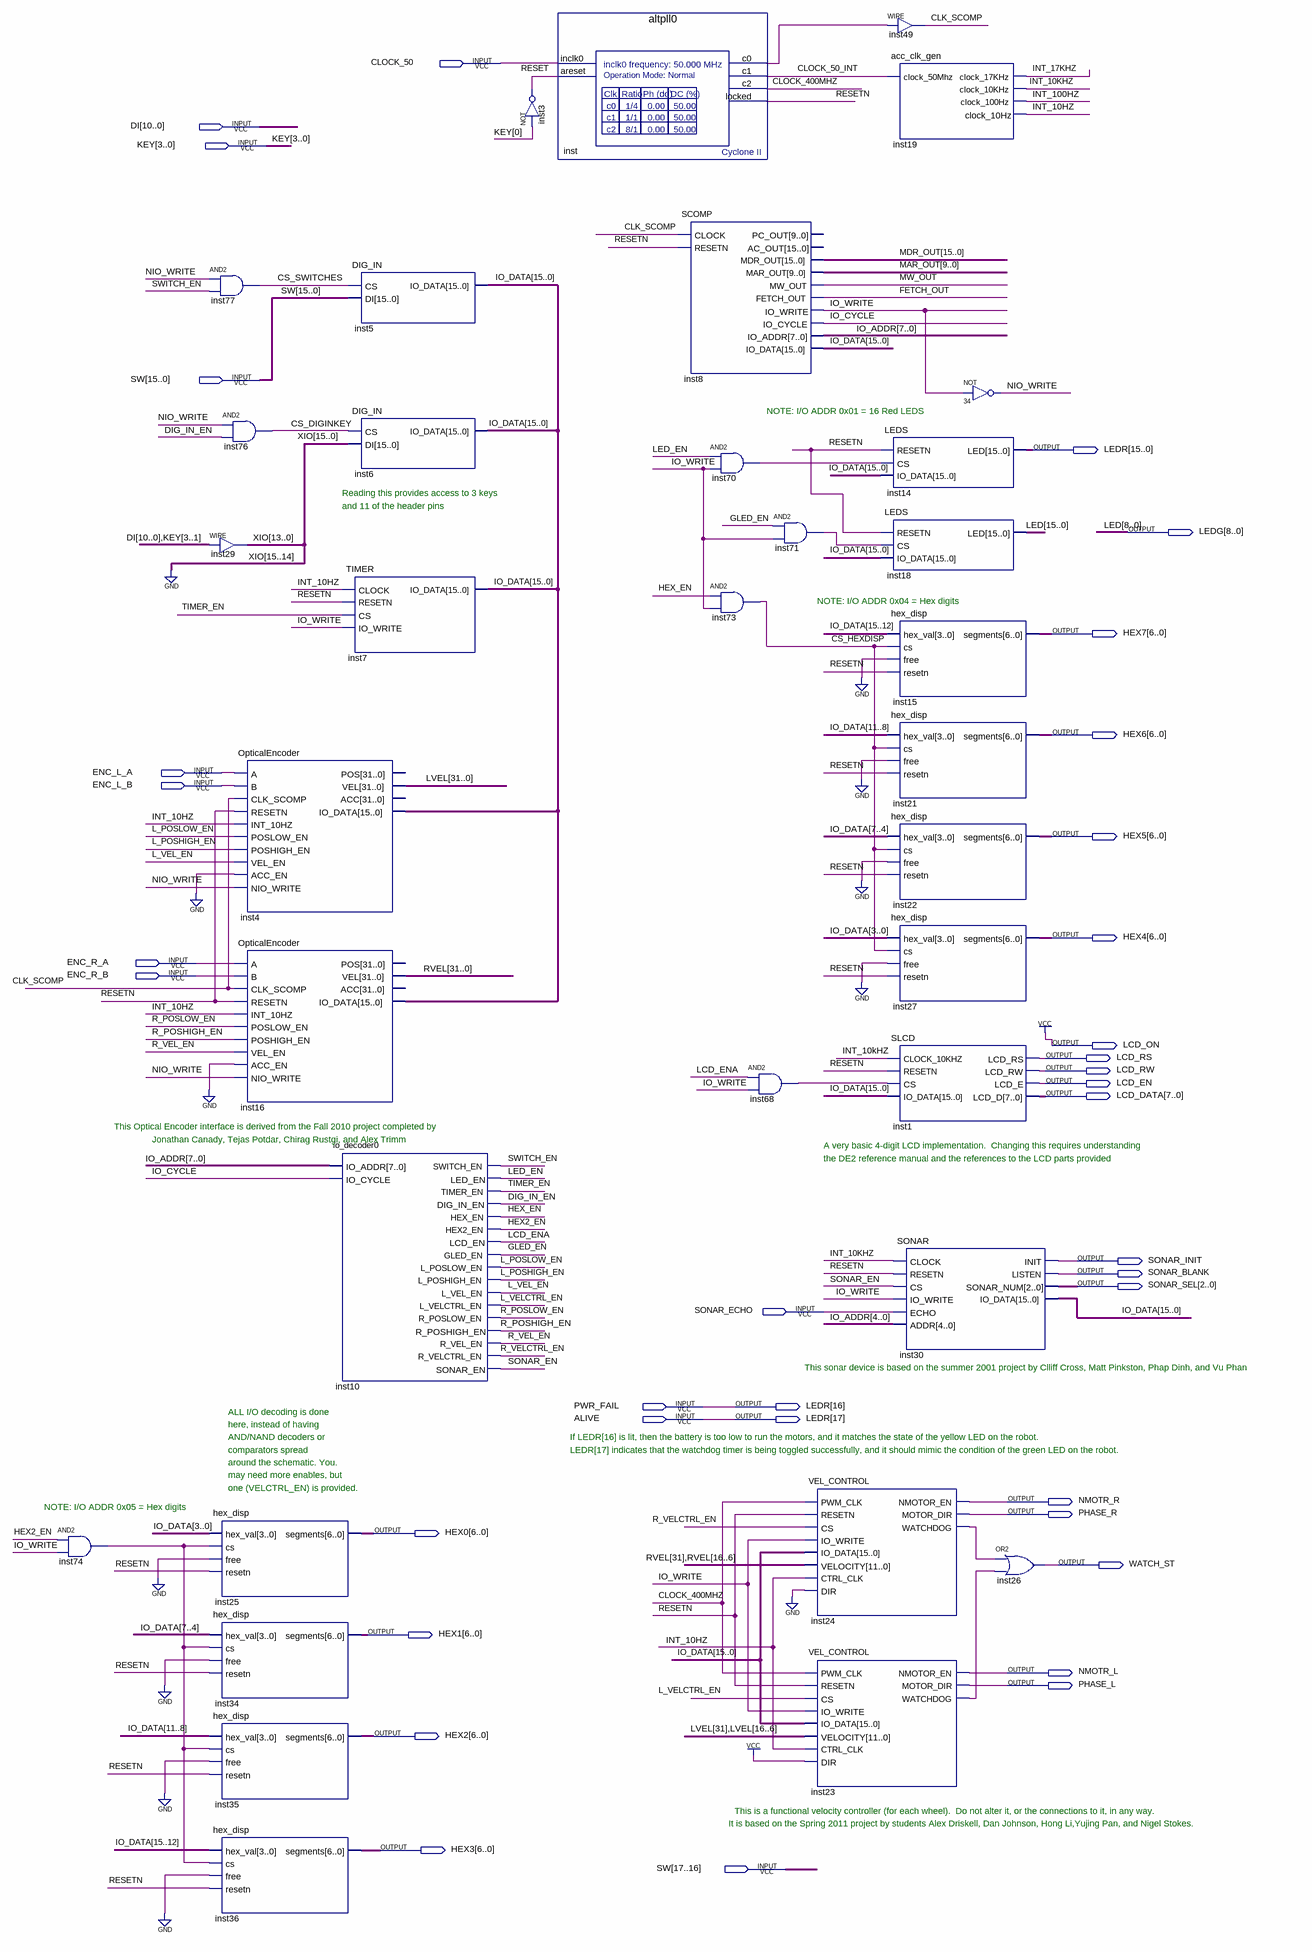
[diagram p0: schematic sheet]
// Quartus schematic DE2bot.bdf as structural Verilog: 35 symbols, 37 pins
module DE2bot (
  input  CLOCK_50,
  input  [10:0] DI,
  input  [3:0] KEY,
  input  [17:0] SW,
  input  ENC_L_A,
  input  ENC_L_B,
  input  ENC_R_A,
  input  ENC_R_B,
  input  SONAR_ECHO,
  input  PWR_FAIL,
  input  ALIVE,
  output [17:0] LEDR,
  output [8:0] LEDG,
  output [6:0] HEX7,
  output [6:0] HEX6,
  output [6:0] HEX5,
  output [6:0] HEX4,
  output LCD_ON,
  output LCD_RS,
  output LCD_RW,
  output LCD_EN,
  output [7:0] LCD_DATA,
  output SONAR_INIT,
  output SONAR_BLANK,
  output [2:0] SONAR_SEL,
  output NMOTR_R,
  output PHASE_R,
  output [6:0] HEX0,
  output WATCH_ST,
  output [6:0] HEX1,
  output NMOTR_L,
  output PHASE_L,
  output [6:0] HEX2,
  output [6:0] HEX3
);

  wire CLK_SCOMP, CLOCK_50_INT, CLOCK_400MHZ, CS_DIGINKEY, CS_HEXDISP, CS_SWITCHES, DIG_IN_EN, FETCH_OUT,
       GLED_EN, HEX2_EN, HEX_EN, inst23_watchdog, inst24_watchdog, inst68_out, inst70_out, inst71_out,
       inst74_out, inst_c0, INT_10HZ, INT_10kHZ, INT_17KHZ, INT_100HZ, IO_CYCLE, IO_WRITE, L_POSHIGH_EN,
       L_POSLOW_EN, L_VEL_EN, L_VELCTRL_EN, LCD_ENA, LED_EN, MW_OUT, NIO_WRITE, R_POSHIGH_EN, R_POSLOW_EN,
       R_VEL_EN, R_VELCTRL_EN, RESET, RESETN, SONAR_EN, SWITCH_EN, TIMER_EN;
  wire [7:0] IO_ADDR;
  wire [9:0] MAR_OUT;
  wire [13:0] XIO;
  wire [15:0] IO_DATA, MDR_OUT;
  wire [15:9] LED;
  wire [31:0] LVEL, RVEL;

  and inst74 (inst74_out, HEX2_EN, IO_WRITE);
  and inst77 (CS_SWITCHES, NIO_WRITE, SWITCH_EN);
  assign XIO = {DI, KEY[3:1]};  // WIRE inst29
  hex_disp inst25 (.hex_val(IO_DATA[3:0]), .cs(inst74_out), .free(1'b0), .resetn(RESETN), .segments(HEX0));
  hex_disp inst34 (.hex_val(IO_DATA[7:4]), .cs(inst74_out), .free(1'b0), .resetn(RESETN), .segments(HEX1));
  hex_disp inst35 (.hex_val(IO_DATA[11:8]), .cs(inst74_out), .free(1'b0), .resetn(RESETN), .segments(HEX2));
  hex_disp inst36 (.hex_val(IO_DATA[15:12]), .cs(inst74_out), .free(1'b0), .resetn(RESETN), .segments(HEX3));
  and inst76 (CS_DIGINKEY, NIO_WRITE, DIG_IN_EN);
  OpticalEncoder inst4 (
    .A(ENC_L_A), .B(ENC_L_B), .CLK_SCOMP(CLK_SCOMP), .RESETN(RESETN), .INT_10HZ(INT_10HZ),
    .POSLOW_EN(L_POSLOW_EN), .POSHIGH_EN(L_POSHIGH_EN), .VEL_EN(L_VEL_EN), .ACC_EN(1'b0),
    .NIO_WRITE(NIO_WRITE), .VEL(LVEL), .IO_DATA(IO_DATA));  // open: POS, ACC
  OpticalEncoder inst16 (
    .A(ENC_R_A), .B(ENC_R_B), .CLK_SCOMP(CLK_SCOMP), .RESETN(RESETN), .INT_10HZ(INT_10HZ),
    .POSLOW_EN(R_POSLOW_EN), .POSHIGH_EN(R_POSHIGH_EN), .VEL_EN(R_VEL_EN), .ACC_EN(1'b0),
    .NIO_WRITE(NIO_WRITE), .VEL(RVEL), .IO_DATA(IO_DATA));  // open: POS, ACC
  DIG_IN inst5 (.CS(CS_SWITCHES), .DI(SW[15:0]), .IO_DATA(IO_DATA));
  DIG_IN inst6 (.CS(CS_DIGINKEY), .DI({2'b00, XIO}), .IO_DATA(IO_DATA));
  TIMER inst7 (.CLOCK(INT_10HZ), .RESETN(RESETN), .CS(TIMER_EN), .IO_WRITE(IO_WRITE), .IO_DATA(IO_DATA));
  io_decoder0 inst10 (
    .IO_ADDR(IO_ADDR), .IO_CYCLE(IO_CYCLE), .SWITCH_EN(SWITCH_EN), .LED_EN(LED_EN), .TIMER_EN(TIMER_EN),
    .DIG_IN_EN(DIG_IN_EN), .HEX_EN(HEX_EN), .HEX2_EN(HEX2_EN), .LCD_EN(LCD_ENA), .GLED_EN(GLED_EN),
    .L_POSLOW_EN(L_POSLOW_EN), .L_POSHIGH_EN(L_POSHIGH_EN), .L_VEL_EN(L_VEL_EN), .L_VELCTRL_EN(L_VELCTRL_EN),
    .R_POSLOW_EN(R_POSLOW_EN), .R_POSHIGH_EN(R_POSHIGH_EN), .R_VEL_EN(R_VEL_EN), .R_VELCTRL_EN(R_VELCTRL_EN),
    .SONAR_EN(SONAR_EN));
  not inst3 (RESET, KEY[0]);
  altpll0 inst (.inclk0(CLOCK_50), .areset(RESET), .c0(inst_c0), .c1(CLOCK_50_INT), .c2(CLOCK_400MHZ), .locked(RESETN));
  SCOMP inst8 (
    .CLOCK(CLK_SCOMP), .RESETN(RESETN), .MDR_OUT(MDR_OUT), .MAR_OUT(MAR_OUT), .MW_OUT(MW_OUT),
    .FETCH_OUT(FETCH_OUT), .IO_WRITE(IO_WRITE), .IO_CYCLE(IO_CYCLE), .IO_ADDR(IO_ADDR), .IO_DATA(IO_DATA));  // open: PC_OUT, AC_OUT
  and inst70 (inst70_out, LED_EN, IO_WRITE);
  and inst73 (CS_HEXDISP, HEX_EN, IO_WRITE);
  and inst71 (inst71_out, GLED_EN, IO_WRITE);
  and inst68 (inst68_out, LCD_ENA, IO_WRITE);
  VEL_CONTROL inst24 (
    .PWM_CLK(CLOCK_400MHZ), .RESETN(RESETN), .CS(R_VELCTRL_EN), .IO_WRITE(IO_WRITE), .IO_DATA(IO_DATA),
    .VELOCITY({RVEL[31], RVEL[16:6]}), .CTRL_CLK(INT_10HZ), .DIR(1'b0), .NMOTOR_EN(NMOTR_R),
    .MOTOR_DIR(PHASE_R), .WATCHDOG(inst24_watchdog));
  VEL_CONTROL inst23 (
    .PWM_CLK(CLOCK_400MHZ), .RESETN(RESETN), .CS(L_VELCTRL_EN), .IO_WRITE(IO_WRITE), .IO_DATA(IO_DATA),
    .VELOCITY({LVEL[31], LVEL[16:6]}), .CTRL_CLK(INT_10HZ), .DIR(1'b1), .NMOTOR_EN(NMOTR_L),
    .MOTOR_DIR(PHASE_L), .WATCHDOG(inst23_watchdog));
  assign CLK_SCOMP = inst_c0;  // WIRE inst49
  acc_clk_gen inst19 (
    .clock_50Mhz(CLOCK_50_INT), .clock_17KHz(INT_17KHZ), .clock_10KHz(INT_10kHZ), .clock_100Hz(INT_100HZ),
    .clock_10Hz(INT_10HZ));
  LEDS inst14 (.RESETN(RESETN), .CS(inst70_out), .IO_DATA(IO_DATA), .LED(LEDR[15:0]));
  LEDS inst18 (.RESETN(RESETN), .CS(inst71_out), .IO_DATA(IO_DATA), .LED({LED, LEDG}));
  hex_disp inst15 (.hex_val(IO_DATA[15:12]), .cs(CS_HEXDISP), .free(1'b0), .resetn(RESETN), .segments(HEX7));
  hex_disp inst21 (.hex_val(IO_DATA[11:8]), .cs(CS_HEXDISP), .free(1'b0), .resetn(RESETN), .segments(HEX6));
  hex_disp inst22 (.hex_val(IO_DATA[7:4]), .cs(CS_HEXDISP), .free(1'b0), .resetn(RESETN), .segments(HEX5));
  hex_disp inst27 (.hex_val(IO_DATA[3:0]), .cs(CS_HEXDISP), .free(1'b0), .resetn(RESETN), .segments(HEX4));
  SLCD inst1 (
    .CLOCK_10KHZ(INT_10kHZ), .RESETN(RESETN), .CS(inst68_out), .IO_DATA(IO_DATA), .LCD_RS(LCD_RS),
    .LCD_RW(LCD_RW), .LCD_E(LCD_EN), .LCD_D(LCD_DATA));
  SONAR inst30 (
    .CLOCK(INT_10kHZ), .RESETN(RESETN), .CS(SONAR_EN), .IO_WRITE(IO_WRITE), .ECHO(SONAR_ECHO),
    .ADDR(IO_ADDR[4:0]), .INIT(SONAR_INIT), .LISTEN(SONAR_BLANK), .SONAR_NUM(SONAR_SEL), .IO_DATA(IO_DATA));
  not u_34 (NIO_WRITE, IO_WRITE);
  or inst26 (WATCH_ST, inst24_watchdog, inst23_watchdog);

  assign LCD_ON = 1'b1;
  assign LEDR[17:16] = {ALIVE, PWR_FAIL};

  // Other names for the same wires on the sheet: LED[8:0] = LEDG

  // Notes on the sheet:
  //   NOTE: I/O ADDR 0x01 = 16 Red LEDS
  //   Reading this provides access to 3 keys
  //   and 11 of the header pins
  //   NOTE: I/O ADDR 0x04 = Hex digits
  //   This Optical Encoder interface is derived from the Fall 2010 project completed by
  //   Jonathan Canady, Tejas Potdar, Chirag Rustgi, and Alex Trimm
  //   A very basic 4-digit LCD implementation.  Changing this requires understanding
  //   the DE2 reference manual and the references to the LCD parts provided
  //   This sonar device is based on the summer 2001 project by Clliff Cross, Matt Pinkston, Phap Dinh, and Vu Phan
  //   ALL I/O decoding is done
  //   here, instead of having
  //   AND/NAND decoders or
  //   If LEDR[16] is lit, then the battery is too low to run the motors, and it matches the state of the yellow LED on the robot.
  //   comparators spread
  //   LEDR[17] indicates that the watchdog timer is being toggled successfully, and it should mimic the condition of the green LED on the robot.
  //   around the schematic. You.
  //   may need more enables, but
  //   one (VELCTRL_EN) is provided.
  //   NOTE: I/O ADDR 0x05 = Hex digits
  //   This is a functional velocity controller (for each wheel).  Do not alter it, or the connections to it, in any way.
  //   It is based on the Spring 2011 project by students Alex Driskell, Dan Johnson, Hong Li,Yujing Pan, and Nigel Stokes.
endmodule
